# Altium schematic sheet LV2.schdoc: +48V to +5V Isolated supply
size A4; Author: Samer Kilani; DrawnBy: Samer Kilani; Engineer: Samer Kilani; Organization: UCL; DocumentNumber: 3; Revision: 2.0; SheetNumber: 3; SheetTotal: 4; ProjectName: G-2 Low Voltage
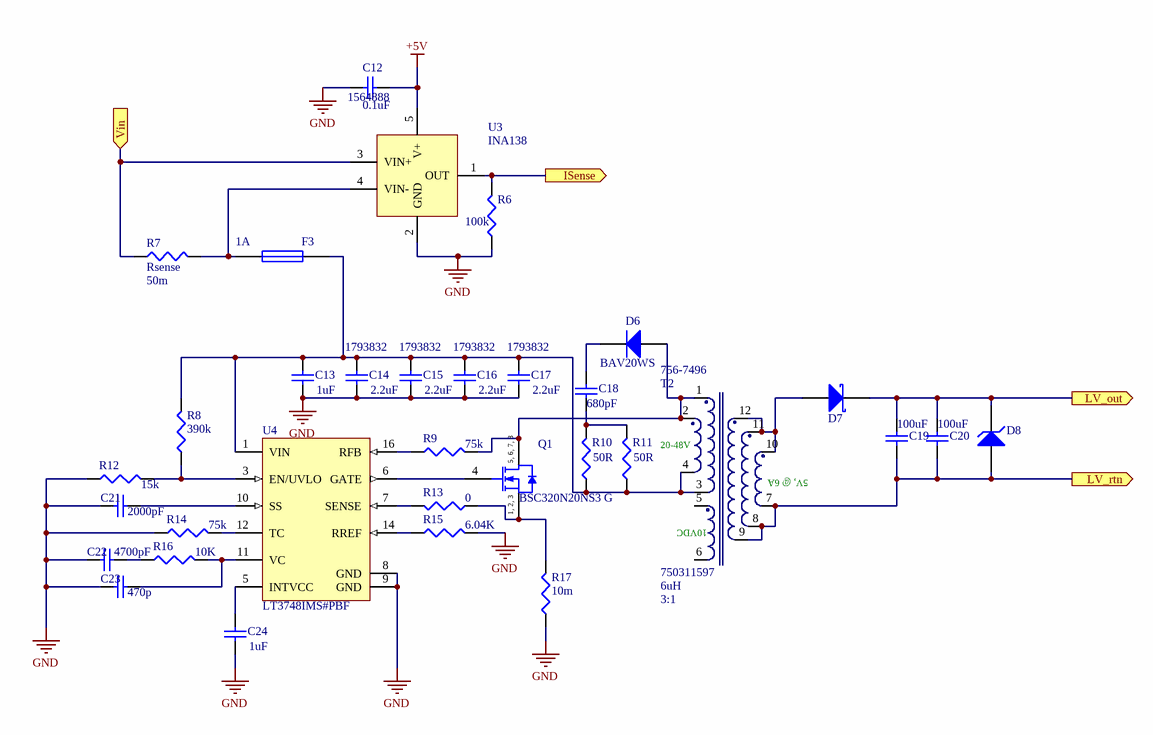
[diagram p0: LV2.schdoc]

## Parts
C12  value 0.1uF  [1608[0603]]  (hidden comment: Cap Semi)
C13  value 1uF  [C0805]  (hidden comment: Cap Semi)
C14  value 2.2uF  Supplier Part Number 1: 1793832  [C1210]  (hidden comment: Cap Semi)
C15  value 2.2uF  Supplier Part Number 1: 1793832  [C1210]  (hidden comment: Cap Semi)
C16  value 2.2uF  Supplier Part Number 1: 1793832  [C1210]  (hidden comment: Cap Semi)
C17  value 2.2uF  Supplier Part Number 1: 1793832  [C1210]  (hidden comment: Cap Semi)
C18  value 680pF  [C0805]  (hidden comment: Cap Semi)
C19  value 100uF  [C1210]  (hidden comment: Cap Semi)
C20  value 100uF  [C1210]  (hidden comment: Cap Semi)
C21  value 2000pF  [1608[0603]]  (hidden comment: Cap Semi)
C22  value 4700pF  [1608[0603]]  (hidden comment: Cap Semi)
C23  value 470p  [1608[0603]]  (hidden comment: Cap Semi)
C24  value 1uF  [C0805]  (hidden comment: Cap Semi)
D6  BAV20WS  [SOD-323]
D7  PDS760-13  [PDS1040L]  (value not drawn)
D8  BZT52H-B5V6  [SOD123F]  (value not drawn)
F3  Tripping current: 1A  [MC33192]
Q1  BSC320N20NS3 G  [INF-PG-TDSON-8-1_V]
R6  value 100k  [J1-0603]  (hidden comment: Res3)
R7  Rsense  value 50m  [R6432]
R8  value 390k  [J1-0603]  (hidden comment: Res3)
R9  value 75k  [J1-0603]  (hidden comment: Res3)
R10  value 50R  [C1206]  (hidden comment: Res3)
R11  value 50R  [C1206]  (hidden comment: Res3)
R12  value 15k  [J1-0603]  (hidden comment: Res3)
R13  value 0  [J1-0603]  (hidden comment: Res3)
R14  value 75k  [J1-0603]  (hidden comment: Res3)
R15  value 6.04K  [J1-0603]  (hidden comment: Res3)
R16  value 10K  [J1-0603]  (hidden comment: Res3)
R17  value 10m  [C1206]  (hidden comment: Res3)
T2  750311597  Supplier Part Number 1: 756-7496  Lpri: 6uH  N: 3:1  [EFD20]
U3  INA138  Supplier Part Number 1: 1564888  [SOT-23]
U4  LT3748IMS#PBF  [LT-MS-16-4PR_N]

## Ports
ISense (out), LV_out (out), LV_rtn (out), Vin (in)

## Nets
+5V: C12.2 U3.5(V+)
GND: C12.1 C13.1 C14.1 C15.1 C16.1 C17.1 C21.1 C22.1 C23.1 C24.1 R6.1 R12.1 R14.1 R15.2 R17.1 U3.2(GND) U4.8(GND) U4.9(GND)
ISense: R6.2 U3.1(OUT) ; port ISense
LV_out: C19.2 C20.2 D7.2(K) D8.2(K) ; port LV_out
LV_rtn: C19.1 C20.1 D8.1(A) T2.7 T2.8 T2.9 ; port LV_rtn
Vin: R7.1 U3.3(VIN+) ; port Vin
NetC13_2: C13.2 C14.2 C15.2 C16.2 C17.2 F3.2 R8.2 R10.1 R11.1 T2.3 T2.4 U4.1(VIN)
NetC18_1: C18.1 D6.1(K)
NetC18_2: C18.2 R10.2 R11.2
NetC21_2: C21.2 U4.10(SS)
NetC22_2: C22.2 R16.1
NetC23_2: C23.2 R16.2 U4.11(VC)
NetC24_2: C24.2 U4.5(INTVCC)
NetD6_2: D6.2(A) Q1.5(DRAIN) Q1.6(DRAIN) Q1.7(DRAIN) Q1.8(DRAIN) R9.2 T2.1 T2.2
NetD7_1: D7.1(A) T2.10 T2.11 T2.12
NetF3_1: F3.1 R7.2 U3.4(VIN-)
NetQ1_1: Q1.1(SOURCE) Q1.2(SOURCE) Q1.3(SOURCE) R13.1 R17.2
NetQ1_4: Q1.4(GATE) U4.6(GATE)
NetR8_1: R8.1 R12.2 U4.3(EN/UVLO)
NetR9_1: R9.1 U4.16(RFB)
NetR13_2: R13.2 U4.7(SENSE)
NetR14_2: R14.2 U4.12(TC)
NetR15_1: R15.1 U4.14(RREF)

Not connected (* = marked no-connect by the designer): T2 5 6

## Notes on the sheet
- (in symbol 750311597) 5V, @ 6A; 10VDC
- (in symbol BSC320N20NS3 G) 5, 6, 7, 8; 1, 2, 3

## Library data of the parts
C12 = Cap Semi: Capacitor (Semiconductor SIM Model); PartNo: CC0603KRX7R9BB104; Published: 8-Jun-2000; LatestRevisionDate: 29-May-2009; LatestRevisionNote: IPC-7351 Footprint Added.; PackageReference: C1206; Publisher: Altium Limited; PackageDescription: Chip Capacitor
C13 C24 = Cap Semi: Capacitor (Semiconductor SIM Model); PartNo: MC0805F105Z500CT; Published: 8-Jun-2000; LatestRevisionDate: 29-May-2009; LatestRevisionNote: IPC-7351 Footprint Added.; PackageReference: C0805; Publisher: Altium Limited; PackageDescription: Chip Capacitor
C14-C17 = Cap Semi: Capacitor (Semiconductor SIM Model); PartNo: C1210C225K1RACTU; Published: 8-Jun-2000; LatestRevisionDate: 29-May-2009; LatestRevisionNote: IPC-7351 Footprint Added.; PackageReference: C1206; Publisher: Altium Limited; PackageDescription: Chip Capacitor; Supplier 1: Farnell
C18 = Cap Semi: Capacitor (Semiconductor SIM Model); PartNo: 08055A221JAT2A; Published: 8-Jun-2000; LatestRevisionDate: 29-May-2009; LatestRevisionNote: IPC-7351 Footprint Added.; PackageReference: C1206; Publisher: Altium Limited; PackageDescription: Chip Capacitor
C19 C20 = Cap Semi: Capacitor (Semiconductor SIM Model); PartNo: C3225X5R0J107M250AC; Published: 8-Jun-2000; LatestRevisionDate: 29-May-2009; LatestRevisionNote: IPC-7351 Footprint Added.; PackageReference: C1206; Publisher: Altium Limited; PackageDescription: Chip Capacitor
C21 = Cap Semi: Capacitor (Semiconductor SIM Model); Published: 8-Jun-2000; LatestRevisionDate: 29-May-2009; LatestRevisionNote: IPC-7351 Footprint Added.; PackageReference: C1206; Publisher: Altium Limited; PackageDescription: Chip Capacitor
C22 = Cap Semi: Capacitor (Semiconductor SIM Model); PartNo: 04025C472KAT2A; Published: 8-Jun-2000; LatestRevisionDate: 29-May-2009; LatestRevisionNote: IPC-7351 Footprint Added.; PackageReference: C1206; Publisher: Altium Limited; PackageDescription: Chip Capacitor
C23 = Cap Semi: Capacitor (Semiconductor SIM Model); PartNo: C1005C0G1H471J050BA; Published: 8-Jun-2000; LatestRevisionDate: 29-May-2009; LatestRevisionNote: IPC-7351 Footprint Added.; PackageReference: C1206; Publisher: Altium Limited; PackageDescription: Chip Capacitor
D6 = BAV20WS: Power Diode; Note: Pin 2 is not connected and not drawn.; Published: 21-Mar-2003; LatestRevisionDate: 29-May-2009; LatestRevisionNote: IPC-7351 Footprint Added.; DatasheetVersion: Oct-1999; PackageVersion: Sep-2001; PackageReference: SOT-23; Publisher: Altium Limited; PackageDescription: 3-Pin SOT-23 Package 0.95 mm Pitch, 2.5 mm Lead Span; ComponentLink1Description: Manufacturer Link; ComponentLink1URL: http://www.infineon.com/; ComponentLink2Description: Datasheet; ComponentLink2URL: http://www.infineon.com/upload/Document/cmc_upload/documents/080/656/bas116series.pdf; PartNo: BAV20WS
D7 = PDS1040L: Schottky Diode; PartNo: SBR15U50SP5-13; Published: 8-Jun-2000; LatestRevisionDate: 17-Jul-2002; LatestRevisionNote: Re-released for DXP Platform.; PackageReference: SMC; Publisher: Altium Limited; Code_JEDEC: DO-214-AA
D8 = BZT52H-B5V6: Zener Diode; pin to pad: 1>2 2>1; Published: 8-Jun-2000; LatestRevisionDate: 17-Jul-2002; LatestRevisionNote: Re-released for DXP Platform.; PackageReference: DIODE-0.7; Publisher: Altium Limited; PackageDescription: Diode, Thru-Hole; 2 Leads; 0.7 in Pin Spacing; PartNo: BZT52H-B5V6
F3 = Fuse 1: Fuse; Published: 8-Jun-2000; LatestRevisionDate: 17-Jul-2002; LatestRevisionNote: Re-released for DXP Platform.; PackageReference: PIN-W2/E2.8; Publisher: Altium Limited; PackageDescription: Thru-Hole; 2 Leads; PartNo: MC33192
Q1 = BSC320N20NS3 G: N-Channel OptiMOS 3 Power-Transistor, 200 V VDS, 36 A ID, -55 to 150 degC, PG-TDSON-8-1, Reel, Green; Manufacturer: Infineon; Green: TRUE; ID (max): 36 A; IDpuls (max): 144 A; Polarity: N; Ptot (max): 125 W; QG: 22 nC; RDS (on) (max): 32 mOhm; Rth: 1 K/W; RthJA (max): 1.5 K/W; RthJC (max): 62 K/W; VDS (max): 200 V; VGS(th) (max): 4 V; VGS(th) (min): 2 V; DatasheetVersion: Rev. 2.3; PackageReference: PG-TDSON-8-1; PackageDescription: 8-Pin Plastic (Green) Thin Dual Small Outline Non-Leaded Package, 5.15 x 5.9 mm Body, 1.27 mm Pitch; Supplier 1: Digi-Key; Supplier Part Number 1: BSC320N20NS3 GTR-ND; Supplier 2: Digi-Key; Supplier Part Number 2: BSC320N20NS3 GCT-ND; Supplier 3: Digi-Key; Supplier Part Number 3: BSC320N20NS3 GDKR-ND; Supplier 4: Mouser; Supplier Part Number 4: 726-BSC320N20NS3G; Halogen-free: TRUE; Packing: Reel; Mounting Technology: Surface Mount; PartNo: BSC320N20NS3 G; ComponentLink1Description: Manufacturer URL; ComponentLink1URL: http://www.infineon.com/; ComponentLink2Description: Datasheet; ComponentLink2URL: http://www.infineon.com/dgdl/BSC320N20NS3+G+Rev2.3.pdf?folderId=db3a3043163797a6011637d4bae7003b&fileId=db3a3043243b5f17012495e37b301571; ComponentLink3Description: Package Specification; ComponentLink3URL: http://www.infineon.com/cms/packages/SMD_-_Surface_Mounted_Devices/P-PG-TDSON/P-PG-TDSON-08-01x_2x_3.html?__locale=en
R6 R8-R16 = Res3: Resistor; Published: 8-Jun-2000; LatestRevisionDate: 29-May-2009; LatestRevisionNote: IPC-7351 Footprint Added.; PackageReference: J1-0603; Publisher: Altium Limited; PackageDescription: Chip Resistor
R7 = Rsense: CRF2512-FV-R001ELF; PartNo: MCS3264R050FER; Published: 8-Jun-2000; LatestRevisionDate: 29-May-2009; LatestRevisionNote: IPC-7351 Footprint Added.; PackageReference: J1-0603; Publisher: Altium Limited; PackageDescription: Chip Resistor
R17 = Res3: Resistor; PartNo: LRMAM1206-R01FT5; Published: 8-Jun-2000; LatestRevisionDate: 29-May-2009; LatestRevisionNote: IPC-7351 Footprint Added.; PackageReference: J1-0603; Publisher: Altium Limited; PackageDescription: Chip Resistor
T2 = 750311597: Flyback Transformer suitable or LT3573/ LT3574/ LT3575/ LT3748 WE-FB, Ui=20-48V; Ui: 20-48V; PackageReference: EFD20; PartNo: 750311597; ComponentLink1Description: Manufacturer URL; ComponentLink1URL: http://www.we-online.com; ComponentLink2Description: Datasheet; ComponentLink2URL: http://katalog.we-online.de/pbs/datasheet/750311597.pdf; Supplier 1: RS-Components
U3 = INA138: PartNo: INA138NA/250; Supplier 1: Farnell
U4 = LT3748IMS#PBF: Isolated Flyback Controller, 16-pin SOP (MS-16), -40 to 125 degC, Pb-Free; Manufacturer: Linear Technology; Number of Outputs: 1; DatasheetVersion: Rev. A; PackageVersion: Rev. B, 05/2013; PackageReference: MS-16; PackageDescription: 12-Pin Plastic MSOP, Body 4.039 x 3 mm, Pitch 0.5 mm; Supplier 1: Digi-Key; Supplier Part Number 1: LT3748IMS#PBF-ND; Supplier 2: Farnell; Supplier Part Number 2: 1898624; Supplier 3: Newark; Supplier Part Number 3: 84R5101; RoHS: TRUE; Mounting Technology: Surface Mount; PartNo: LT3748IMS#PBF; ComponentLink1Description: Manufacturer URL; ComponentLink1URL: http://www.linear.com/; ComponentLink2Description: Datasheet; ComponentLink2URL: http://cds.linear.com/docs/en/datasheet/3748fa.pdf; ComponentLink3Description: Package Specification; ComponentLink3URL: http://cds.linear.com/docs/en/packaging/05081847_B_MS16(12).pdf